# EAGLE schematic Farmduino_bêta (EAGLE 7.2.0)

## Sheet 1 of 2
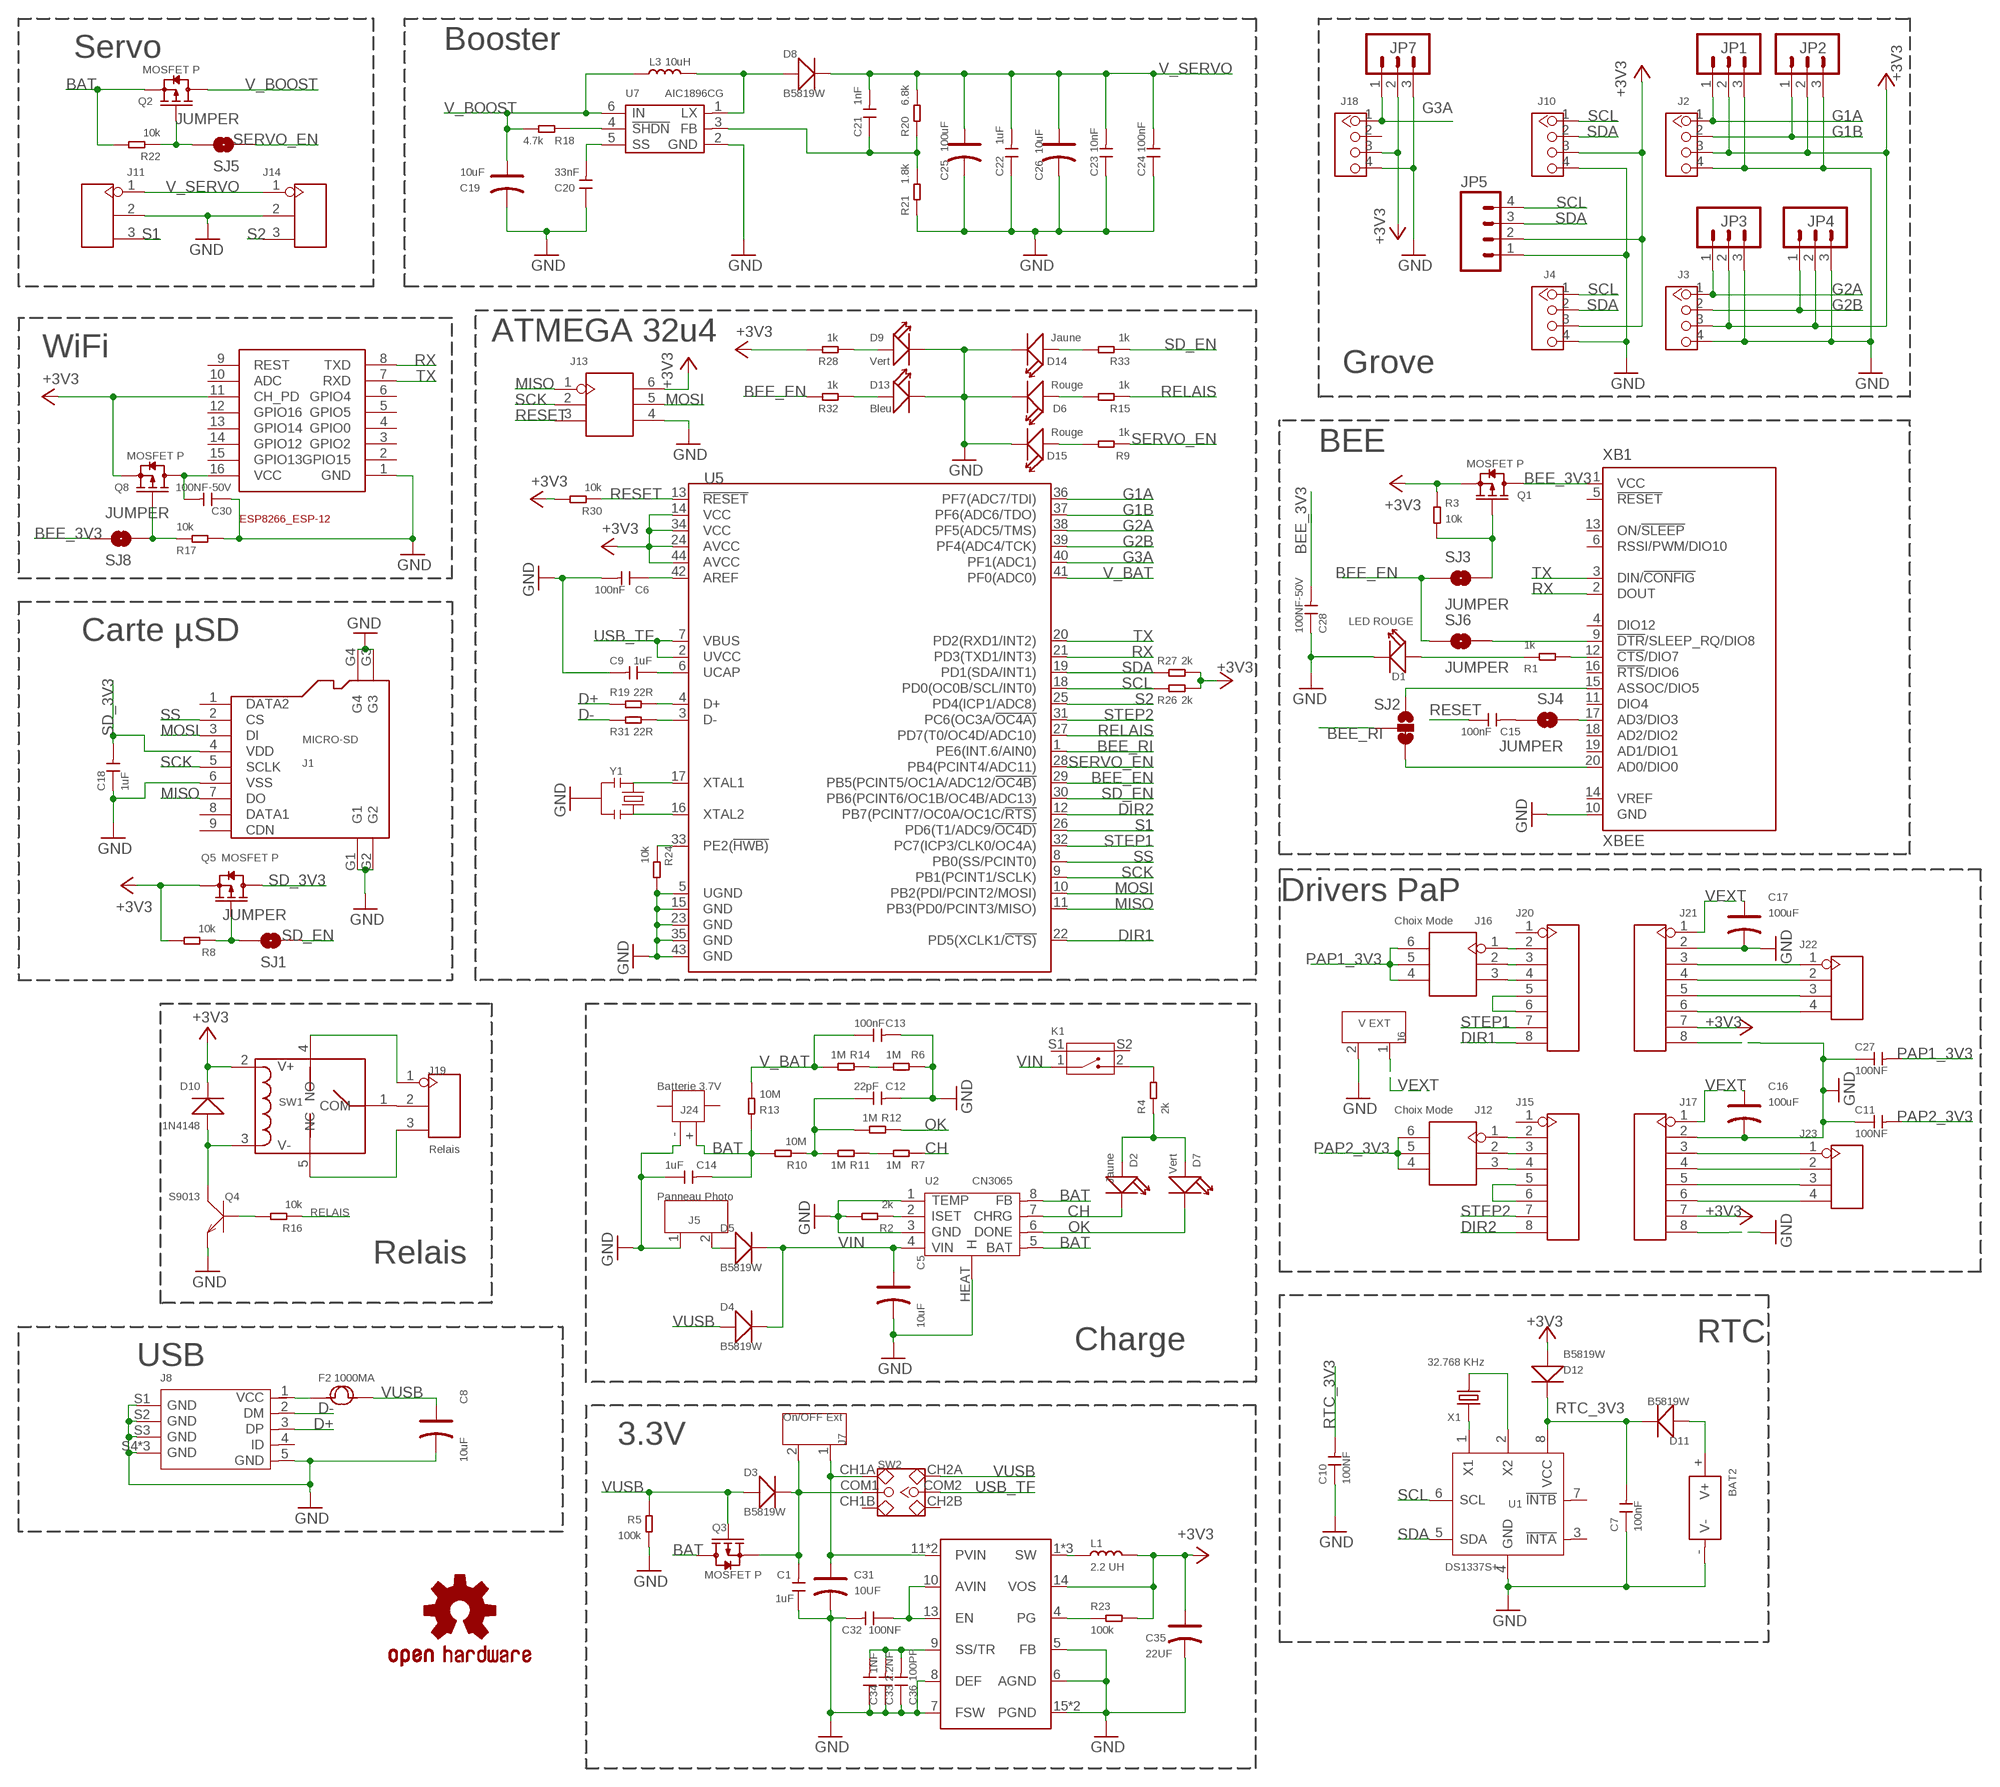
[diagram p0: schematic, sheet 1]

### Parts
BAT2  SMD-BATTERY-CELL-HOLDER-PLASTIC  [BAT2P-SMD-16.4-CR1220]
C1  1uF  CERAMIC-1UF-25V-10%-X7R(0805)  [C0805]
C5  10uF  TANTALUM-SMD-10UF-16V-10%(AVX-A)  [AVX-A]
C6  100nF  CERAMIC-100NF-50V-10%-X7R(0805)  [C0805]
C7  100nF  CERAMIC-100NF-50V-10%-X7R(0805)  [C0805]
C8  10uF  TANTALUM-SMD-10UF-16V-10%(AVX-A)  [AVX-A]
C9  1uF  CERAMIC-1UF-25V-10%-X7R(0805)  [C0805]
C10  100NF  CERAMIC-100NF-50V-10%-X7R(0805)  [C0805]
C11  100NF  CERAMIC-100NF-50V-10%-X7R(0805)  [C0805]
C12  22pF  CERAMIC-22PF-50V-5%-NPO(0805)  [C0805]
C13  100nF  CERAMIC-100NF-50V-10%-X7R(0805)  [C0805]
C14  1uF  CERAMIC-1UF-25V-10%-X7R(0805)  [C0805]
C15  100nF  CERAMIC-100NF-50V-10%-X7R(0805)  [C0805]
C16  100uF  ALUMINUM-SMD-100UF-50V-20%  [ELECTRO-SMD-C-6MM]
C17  100uF  ALUMINUM-SMD-100UF-50V-20%  [ELECTRO-SMD-C-6MM]
C18  1uF  CERAMIC-1UF-25V-10%-X7R(0805)  [C0805]
C19  10uF  TANTALUM-SMD-10UF-10V-10%(AVX-A)  [AVX-A]
C20  33nF  CERAMIC-33NF-50V-10%-X7R(0603)  [C0603]
C21  1nF  CERAMIC-1NF-50V-5%-C0G(0603)  [C0603]
C22  1uF  CERAMIC-1UF-25V-10%-X7R(0805)  [C0805]
C23  10nF  CERAMIC-10NF-50V-5%-X7R(0805)  [C0805]
C24  100nF  CERAMIC-100NF-50V-10%-X7R(0805)  [C0805]
C25  100uF  TANTALUM-SMD-100UF-10V(AVX-B)  [AVX-B]
C26  10uF  TANTALUM-SMD-10UF-16V-10%(AVX-A)  [AVX-A]
C27  100NF  CERAMIC-100NF-50V-10%-X7R(0805)  [C0805]
C28  100NF-50V  CERAMIC-100NF-50V-10%-X7R(0805)  [C0805]
C30  100NF-50V  CERAMIC-100NF-50V-10%-X7R(0805)  [C0805]
C31  10UF  TANTALUM-SMD-10UF-16V-10%(AVX-A)  [AVX-A]
C32  100NF  CERAMIC-100NF-50V-10%-X7R(0805)  [C0805]
C33  2.2NF  CERAMIC-2.2NF-50V-10%-X7R(0603)  [C0603]
C34  1NF  CERAMIC-1NF-50V-5%-C0G(0603)  [C0603]
C35  22UF  TANTALUM-SMD-22UF-16V(AVX-B)  [AVX-B]
C36  100PF  CERAMIC-100PF-50V-5%-NPO(0603)  [C0603]
D1  LED ROUGE  LED-SMD-RED-DIFFUSED(0603)  [LED-0603]
D2  Jaune  SMD-LED-CLEAR-YELLOW(0805)  [LED-0805]
D3  B5819W  SMD-DIODE-SCHOTTKY-20V-1A(SOD-123)  [SOD-123]
D4  B5819W  SMD-DIODE-SCHOTTKY-20V-1A(SOD-123)  [SOD-123]
D5  B5819W  SMD-DIODE-SCHOTTKY-20V-1A(SOD-123)  [SOD-123]
D6  Rouge  LED-SMD-RED-DIFFUSED(0603)  [LED-0603]
D7  Vert  SMD-LED-CLEAR-GREEN(0805)  [LED-0805]
D8  B5819W  SMD-DIODE-SCHOTTKY-20V-1A(SOD-123)  [SOD-123]
D9  Vert  SMD-LED-CLEAR-GREEN(0603)  [LED-0603]
D10  1N4148  SMD-DIODE-SWITCH-1N4148(LL-34)  [LL-34]
D11  B5819W  SMD-DIODE-SCHOTTKY-20V-1A(SOD-123)  [SOD-123]
D12  B5819W  SMD-DIODE-SCHOTTKY-20V-1A(SOD-123)  [SOD-123]
D13  Bleu  SMD-LED-CLEAR-BLUE(0603)  [LED-0603]
D14  Jaune  SMD-LED-CLEAR-YELLOW(0603)  [LED-0603]
D15  Rouge  LED-SMD-RED-DIFFUSED(0603)  [LED-0603]
F2  1000MA  SMD-PPTC-1000MA-8V(1206)  [F1206]
J1  MICRO-SD  MICRO-SD-CARD-SOCKET-9P(ST-TF-003A)  [MICRO-SD9+4P-SMD-16.1X14.5X1.85MM]
J2  GROVE-CONNECTOR-DIP(4P-2.0)  [HW4-2.0]
J3  GROVE-CONNECTOR-DIP(4P-2.0)  [HW4-2.0]
J4  GROVE-CONNECTOR-DIP(4P-2.0)  [HW4-2.0]
J5  Panneau Photo  SCREW-TERMINAL-GREEN(2P-3.5)  [H2-3.5-7.0X7.0MM]
J6  V EXT  SCREW-TERMINAL-GREEN(2P-3.5)  [H2-3.5-7.0X7.0MM]
J7  On/OFF Ext  SCREW-TERMINAL-GREEN(2P-3.5)  [H2-3.5-7.0X7.0MM]
J8  MICRO-USB-SMD-B-WITHOUT-POST-W/P(ST-USB-001G)  [MICRO-USB5+4P-SMD-0.65-B]
J10  GROVE-CONNECTOR-DIP(4P-2.0)  [HW4-2.0]
J11  DIP-WHITE-MALE-HEADER-VERT(3P-2.54)  [H3-2.54]
J12  Choix Mode  DIP-YELLOW-MALE-HEADER-VERT(2X3P-2.54)  [H2X3-2.54]
J13  DIP-BLACK-MALE-HEADER（2X3P-2.54）-2.54  [H2X3-2.54]
J14  DIP-WHITE-MALE-HEADER-VERT(3P-2.54)  [H3-2.54]
J15  DIP-YELLOW-FEMALE-HEADER(8P-2.54)  [H8-2.54]
J16  Choix Mode  DIP-YELLOW-MALE-HEADER-VERT(2X3P-2.54)  [H2X3-2.54]
J17  DIP-YELLOW-FEMALE-HEADER(8P-2.54)  [H8-2.54]
J18  GROVE-CONNECTOR-DIP(4P-2.0)  [HW4-2.0]
J19  Relais  SCREW-TERMINAL-GREEN(3P-5.0)  [H3-5.0-15.5X8.0MM]
J20  DIP-YELLOW-FEMALE-HEADER(8P-2.54)  [H8-2.54]
J21  DIP-YELLOW-FEMALE-HEADER(8P-2.54)  [H8-2.54]
J22  DIP-BLACK-MALE-HEADER-VERT(4P-2.54)  [H4-2.54]
J23  DIP-BLACK-MALE-HEADER-VERT(4P-2.54)  [H4-2.54]
J24  Batterie 3.7V  SMD-JST-2P-1.0-90D  [HW2-SMD-1.0-90D]
JP1  M03SCREW  [SCREWTERMINAL-3.5MM-3]
JP2  M03SCREW  [SCREWTERMINAL-3.5MM-3]
JP3  M03SCREW  [SCREWTERMINAL-3.5MM-3]
JP4  M03SCREW  [SCREWTERMINAL-3.5MM-3]
JP5  M04SCREW  [SCREWTERMINAL-3.5MM-4]
JP7  M03SCREW  [SCREWTERMINAL-3.5MM-3]
K1  SMD-BUTTON-2+2P  [SW4-SMD-7.0X3.5X3.5MM-90D]
L1  2.2 UH  SMD-INDUCTOR-2.2UH-20%-1.2A(0805)  [L0805]
L3  10uH  SMD-INDUCTOR-10UH-20%-900MA(L1210)  [L1210]
LOGO1  OSHW-LOGOM  [OSHW-LOGO-M]
Q1  MOSFET P  SMD-MOSFET-P-CH-8V-4.1A(SOT-23)  [SOT-23]
Q2  MOSFET P  SMD-MOSFET-P-CH-8V-4.1A(SOT-23)  [SOT-23]
Q3  MOSFET P  SMD-MOSFET-P-CH-8V-4.1A(SOT-23)  [SOT-23]
Q4  S9013  SMD-TRANSISTORS-NPN-25V-500MA(SOT-23)  [SOT-23]
Q5  MOSFET P  SMD-MOSFET-P-CH-8V-4.1A(SOT-23)  [SOT-23]
Q8  MOSFET P  SMD-MOSFET-P-CH-8V-4.1A(SOT-23)  [SOT-23]
R1  1k  SMD-RES-1K-5%-1/8W(0805)  [R0805]
R2  2k  SMD-RES-2K-5%-1/8W(0805)  [R0805]
R3  10k  SMD-RES-10K-1%-1/8W(0805)  [R0805]
R4  2k  SMD-RES-2K-5%-1/8W(0805)  [R0805]
R5  100k  SMD-RES-100K-1%-1/8W(0805)  [R0805]
R6  1M  SMD-RES-1M-1%-1/16W(0402)  [R0402]
R7  1M  SMD-RES-1M-1%-1/16W(0402)  [R0402]
R8  10k  SMD-RES-10K-1%-1/8W(0805)  [R0805]
R9  1k  SMD-RES-1K-5%-1/8W(0805)  [R0805]
R10  10M  SMD-RES-10M-1%-1/10W(0603)  [R0603]
R11  1M  SMD-RES-1M-1%-1/16W(0402)  [R0402]
R12  1M  SMD-RES-1M-5%-1/8W(0805)  [R0805]
R13  10M  SMD-RES-10M-1%-1/10W(0603)  [R0603]
R14  1M  SMD-RES-1M-1%-1/16W(0402)  [R0402]
R15  1k  SMD-RES-1K-5%-1/8W(0805)  [R0805]
R16  10k  SMD-RES-10K-1%-1/8W(0805)  [R0805]
R17  10k  SMD-RES-10K-1%-1/8W(0805)  [R0805]
R18  4.7k  SMD-RES-4.7K-5%-1/8W(0805)  [R0805]
R19  22R  SMD-RES-22R-5%-1/8W(0805)  [R0805]
R20  6.8k  SMD-RES-6.8K-1%-1/10W(0603)  [R0603]
R21  1.8k  SMD-RES-1.8K-1%-1/10W(0603)  [R0603]
R22  10k  SMD-RES-10K-1%-1/8W(0805)  [R0805]
R23  100k  SMD-RES-100K-1%-1/8W(0805)  [R0805]
R24  10k  SMD-RES-10K-1%-1/8W(0805)  [R0805]
R26  2k  SMD-RES-2K-5%-1/10W(0603)  [R0603]
R27  2k  SMD-RES-2K-5%-1/8W(0805)  [R0805]
R28  1k  SMD-RES-1K-5%-1/8W(0805)  [R0805]
R30  10k  SMD-RES-10K-1%-1/8W(0805)  [R0805]
R31  22R  SMD-RES-22R-5%-1/8W(0805)  [R0805]
R32  1k  SMD-RES-1K-5%-1/8W(0805)  [R0805]
R33  1k  SMD-RES-1K-5%-1/8W(0805)  [R0805]
SJ1  JUMPER  JUMPER-PAD-2-NO  [PAD-JUMPER-2-NO_NO_SILK]
SJ2  JUMPER-PAD-3-2OF3_NC_BY_TRACE_LARGE  [PAD-JUMPER-3-2OF3_NC_BY_TRACE_YES_SILK_LARGE]
SJ3  JUMPER  JUMPER-PAD-2-NO  [PAD-JUMPER-2-NO_NO_SILK]
SJ4  JUMPER  JUMPER-PAD-2-NO  [PAD-JUMPER-2-NO_NO_SILK]
SJ5  JUMPER  JUMPER-PAD-2-NO  [PAD-JUMPER-2-NO_NO_SILK]
SJ6  JUMPER  JUMPER-PAD-2-NO  [PAD-JUMPER-2-NO_NO_SILK]
SJ8  JUMPER  JUMPER-PAD-2-NO  [PAD-JUMPER-2-NO_NO_SILK]
SW1  RELAY-HLS8L-DC3V-S-C(5P-19X15MM)  [REY5-19.0X15.0X15.0MM]
SW2  DIP-TOGGLE-SWITCH-2CH-(2X3P-90D)  [SW6-2.54-9.0X3.5X3.2MM-90D]
U1  DS1337S+  CLOCK-DS1337S+(SOIC8)  [SOIC8-1.27-5X4MM]
U2  CN3065  PMIC-CN3065(DFN8)  [DFN8G-0.5-3X3MM]
U3  TPS62132RGTR  PMIC-TPS62132RGTR(QFN16)  [QFN16G-0.5-3X3MM]
U5  MCU-ATMEGA32U4(TQFP44)-AU  [TQFP44-0.8-9.6X9.6MM]
U7  AIC1896CG  PMIC-AIC1896CG(SOT23-6)  [SOT-23-6]
U$1  ESP8266_ESP-12  [ESP8266-ESP12]
X1  32.768 KHz  SMD-CRYSTAL-ABS07-32.768KHZ-7PF-20PPM-70K(2P-3.2X1.5MM)  [X2-SMD-3.2X1.5X0.55MM]
XB1  XBEE  [XBEE]
Y1  SMD-CRYSTAL-8MHZ--0.3%-150R(3P-3.6X1.3MM)  [X3-SMD-3.6X1.3X0.8MM]

### Nets
!SHDN: R18.2 U7.4(!SHDN)
+3V3: C35.+ D10.C(-) D12.+ J2.3 J3.3 J4.3 J10.3 J13.6 J17.7 J18.3 J21.7 JP1.2 JP2.2 JP3.2 JP4.2 JP5.2 JP7.2 L1.2 Q1.2(S) Q5.2(S) Q8.2(S) R3.1 R8.2 R23.2 R26.1 R27.1 R28.2 R30.2 SW1.2(V+) U3.14(VOS) U5.14(VCC) U5.24(AVCC) U5.34(VCC) U5.44(AVCC) U$1.11(CH_PD)
A7: C12.1 R10.1 R11.2 R12.2
BAT: C14.2 J24.+ Q2.2(S) Q3.3(D) R10.2 R13.2 R22.2 U2.5(BAT) U2.8(FB)
BEE_3V3: C28.2 Q1.3(D) SJ8.1 XB1.1(VCC)
BEE_CTS: R1.2 XB1.12(!CTS!/DIO7)
BEE_EN: R32.2 SJ3.1 SJ6.1 U5.29(PB5(PCINT5/OC1A/ADC12/!OC4B))
BEE_RI: SJ2.2 U5.1(PE6(INT.6/AIN0))
CH: D2.- R7.1 U2.7(CHRG)
D6: D1.+ R1.1
D+: J8.3(DP) R19.1
D-: J8.2(DM) R31.1
DIR1: J20.8 U5.22(PD5(XCLK1/!CTS))
DIR2: J15.8 U5.12(PB7(PCINT7/OC0A/OC1C/!RTS))
G1A: J2.1 JP1.1 U5.36(PF7(ADC7/TDI))
G1B: J2.2 JP2.1 U5.37(PF6(ADC6/TDO))
G2A: J3.1 JP3.1 U5.38(PF5(ADC5/TMS))
G2B: J3.2 JP4.1 U5.39(PF4(ADC4/TCK))
G3A: J18.1 JP7.1 U5.40(PF1(ADC1))
GND: BAT2.-(V-) C1.1 C5.- C6.2 C7.1 C8.- C9.2 C10.1 C11.1 C12.2 C13.2 C14.1 C16.- C17.- C18.1 C19.- C20.1 C22.1 C23.1 C24.1 C25.- C26.- C27.1 C28.1 C30.1 C31.- C32.2 C33.1 C34.1 C35.- C36.1 D1.- D6.- D9.- D13.- D14.- D15.- J1.6(VSS) J1.G1 J1.G2 J1.G3 J1.G4 J2.4 J3.4 J4.4 J5.1 J6.2 J8.5(GND) J8.S1(GND) J8.S2(GND) J8.S3(GND) J8.S4(GND) J8.S5(GND) J8.S6(GND) J10.4 J11.2 J13.4 J14.2 J17.2 J17.8 J18.4 J21.2 J21.8 J24.- JP1.3 JP2.3 JP3.3 JP4.3 JP5.1 JP7.3 Q4.2(E) R2.2 R5.1 R6.1 R17.2 R21.1 R24.2 U1.4(GND) U2.1(TEMP) U2.3(GND) U2.HEAT(H) U3.5(FB) U3.6(AGND) U3.7(FSW) U3.8(DEF) U3.15(PGND) U3.16(PGND) U5.5(UGND) U5.15(GND) U5.23(GND) U5.35(GND) U5.43(GND) U7.2(GND) U$1.1(GND) XB1.10(GND) Y1.2
MISO: J1.7(DO) J13.1 U5.11(PB3(PD0/PCINT3/MISO))
MOSI: J1.3(DI) J13.5 U5.10(PB2(PDI/PCINT2/MOSI))
N$1: K1.2 R4.2
N$2: J15.5 J15.6
N$3: D9.+ R28.1
N$4: SJ4.1 XB1.17(AD3/DIO3)
N$5: D13.+ R32.1
N$6: SJ2.1 XB1.15(ASSOC/DIO5)
N$7: SJ2.3 XB1.20(AD0/DIO0)
N$8: R2.1 U2.2(ISET)
N$9: U1.1(X1) X1.1
N$10: U1.2(X2) X1.2
N$11: C15.2 SJ4.2
N$12: U5.16(XTAL2) Y1.3
N$13: BAT2.+(V+) D11.+
N$14: R6.2 R14.1
N$15: D2.+ D7.+ R4.1
N$16: D5.+ J5.2
N$17: R7.2 R11.1
N$18: Q1.1(G) R3.2 SJ3.2
N$19: C1.2 D3.- J7.2 Q3.2(S) SW2.COM1
N$20: C31.+ J7.1 SW2.CH1A U3.11(PVIN) U3.12(PVIN)
N$21: Q5.1(G) R8.1 SJ1.2
N$22: C30.2 Q8.3(D) U$1.16(VCC)
N$23: C20.2 U7.5(SS)
N$24: D8.+ L3.2 U7.1(LX)
N$25: C21.1 R20.1 R21.2 U7.3(FB)
N$26: Q2.1(G) R22.1 SJ5.2
N$27: J16.3 J20.4
N$28: J16.2 J20.3
N$29: D14.+ R33.2
N$30: J16.1 J20.2
N$31: J12.3 J15.4
N$32: J12.2 J15.3
N$33: R24.1 U5.33(PE2(!HWB))
N$34: R31.2 U5.3(D-)
N$35: C9.1 U5.6(UCAP)
N$36: F2.1 J8.1(VCC)
N$37: D6.+ R15.2
N$38: J12.1 J15.2
N$39: J20.5 J20.6
N$41: Q8.1(G) R17.1 SJ8.2
N$42: R19.2 U5.4(D+)
N$43: SJ6.2 XB1.9(!DTR!/SLEEP_RQ/DIO8)
N$44: R23.1 U3.4(PG)
N$46: D15.+ R9.2
N$47: J17.3 J23.1
N$48: J17.4 J23.2
N$49: J17.5 J23.3
N$50: J17.6 J23.4
N$51: C33.2 C34.2 C36.2 U3.9(SS/TR)
N$52: L1.1 U3.1(SW) U3.2(SW) U3.3(SW)
N$53: J21.3 J22.1
N$54: J21.4 J22.2
N$55: J21.5 J22.3
N$56: J21.6 J22.4
N$57: Q4.1(B) R16.2
N$58: D10.A(+) Q4.3(C) SW1.3(V-)
N$61: J19.2 SW1.1(COM)
N$63: C32.1 U3.10(AVIN) U3.13(EN)
N$77: U5.17(XTAL1) Y1.1
N$80: C6.1 U5.42(AREF)
NC1: J19.3 SW1.5(NC)
NO1: J19.1 SW1.4(NO)
OK: D7.- R12.1 U2.6(DONE)
PAP1_3V3: C27.2 J16.4 J16.5 J16.6
PAP2_3V3: C11.2 J12.4 J12.5 J12.6
RELAIS: R15.1 R16.1 U5.27(PD7(T0/OC4D/ADC10))
RESET: C15.1 J13.3 R30.1 U5.13(!RESET)
RTC_3V3: C7.2 C10.2 D11.- D12.- U1.8(VCC)
RX: U5.21(PD3(TXD1/INT3)) U$1.8(TXD) XB1.2(DOUT)
S1: J11.3 U5.26(PD6(T1/ADC9/!OC4D))
S2: J14.3 U5.25(PD4(ICP1/ADC8))
SCK: J1.5(SCLK) J13.2 U5.9(PB1(PCINT1/SCLK))
SCL: J4.1 J10.1 JP5.4 R26.2 U1.6(SCL) U5.18(PD0(OC0B/SCL/INT0))
SD_3V3: C18.2 J1.4(VDD) Q5.3(D)
SD_EN: R33.1 SJ1.1 U5.30(PB6(PCINT6/OC1B/OC4B/ADC13))
SDA: J4.2 J10.2 JP5.3 R27.2 U1.5(SDA) U5.19(PD1(SDA/INT1))
SERVO_EN: R9.1 SJ5.1 U5.28(PB4(PCINT4/ADC11))
SS: J1.2(CS) U5.8(PB0(SS/PCINT0))
STEP1: J20.7 U5.32(PC7(ICP3/CLK0/OC4A))
STEP2: J15.7 U5.31(PC6(OC3A/!OC4A))
TX: U5.20(PD2(RXD1/INT2)) U$1.7(RXD) XB1.3(DIN/!CONFIG)
USB_TF: SW2.COM2 U5.2(UVCC) U5.7(VBUS)
V_BAT: C13.1 R13.1 R14.2 U5.41(PF0(ADC0))
V_BOOST: C19.+ L3.1 Q2.3(D) R18.1 U7.6(IN)
V_SERVO: C21.2 C22.2 C23.2 C24.2 C25.+ C26.+ D8.- J11.1 J14.1 R20.2
VEXT: C16.+ C17.+ J6.1 J17.1 J21.1
VIN: C5.+ D4.- D5.- K1.1 U2.4(VIN)
VUSB: C8.+ D3.+ D4.+ F2.2 Q3.1(G) R5.2 SW2.CH2A
Unconnected: J1.1(DATA2) J1.8(DATA1) J1.9(CDN) J8.4(ID) J15.1 J18.2 J20.1 J24.3 J24.4 K1.S1 K1.S2 SW2.CH1B SW2.CH2B U1.3(!INTA!) U1.7(!INTB!) U$1.2(GPIO15) U$1.3(GPIO2) U$1.4(GPIO0) U$1.5(GPIO5) U$1.6(GPIO4) U$1.9(REST) U$1.10(ADC) U$1.12(GPIO16) U$1.13(GPIO14) U$1.14(GPIO12) U$1.15(GPIO13) XB1.4(DIO12) XB1.5(!RESET) XB1.6(RSSI/PWM/DIO10) XB1.11(DIO4) XB1.13(ON/!SLEEP) XB1.14(VREF) XB1.16(!RTS!/DIO6) XB1.18(AD2/DIO2) XB1.19(AD1/DIO1)

### Notes on the sheet
- Servo | Booster
- ATMEGA 32u4
- WiFi
- Grove
- BEE
- Carte µSD
- Drivers PaP
- Relais
- Charge | RTC
- USB
- 3.3V

## Sheet 2 of 2

## Library data of the parts
BAT2 = 0_Seeed-OPL-Connector:SMD-BATTERY-CELL-HOLDER-PLASTIC: 320170000; OC_FARNELL: unknown
C1 C14 C18 C22 = 0_Seeed-OPL-Capacitor:CERAMIC-1UF-25V-10%-X7R(0805): 302010179; MF: AVX; MPN: 02016D105MAT2A; OC_FARNELL: 1867951
C5 C8 = 0_Seeed-OPL-Capacitor:TANTALUM-SMD-10UF-16V-10%(AVX-A): 302020002; MF: AVX; MPN: 06036D106MAT2A; OC_FARNELL: 2448826
C6 C7 C13 C15 C24 = 0_Seeed-OPL-Capacitor:CERAMIC-100NF-50V-10%-X7R(0805): 302010165; MF: AVX; MPN: 0402ZD104KAT2A; OC_FARNELL: 2280810
C9 = 0_Seeed-OPL-Capacitor:CERAMIC-1UF-25V-10%-X7R(0805): 302010179; MF: AVX; MPN: CC0805KKX7R8BB105; OC_FARNELL: 1867951
C10 C11 C27 C28 C30 = 0_Seeed-OPL-Capacitor:CERAMIC-100NF-50V-10%-X7R(0805): 302010165; OC_FARNELL: unknown
C12 = 0_Seeed-OPL-Capacitor:CERAMIC-22PF-50V-5%-NPO(0805): 302010151; OC_FARNELL: unknown
C16 C17 = 0_Seeed-OPL-Capacitor:ALUMINUM-SMD-100UF-50V-20%: 302030090; MF: AVX; MPN: 06036D106MAT2A; OC_FARNELL: 2448826
C19 = 0_Seeed-OPL-Capacitor:TANTALUM-SMD-10UF-10V-10%(AVX-A): 302020011; MPN: TAJA106K010RNJ; OC_FARNELL: unknown
C20 = 0_Seeed-OPL-Capacitor:CERAMIC-33NF-50V-10%-X7R(0603): 302010088; OC_FARNELL: unknown
C21 C34 = 0_Seeed-OPL-Capacitor:CERAMIC-1NF-50V-5%-C0G(0603): 302010341; OC_FARNELL: unknown
C23 = 0_Seeed-OPL-Capacitor:CERAMIC-10NF-50V-5%-X7R(0805): 302010175; OC_FARNELL: unknown
C25 = 0_Seeed-OPL-Capacitor:TANTALUM-SMD-100UF-10V(AVX-B): 302020015; OC_FARNELL: unknown
C26 C31 = 0_Seeed-OPL-Capacitor:TANTALUM-SMD-10UF-16V-10%(AVX-A): 302020002; MPN: TAJA106K016RNJ; OC_FARNELL: unknown
C32 = 0_Seeed-OPL-Capacitor:CERAMIC-100NF-50V-10%-X7R(0805): 302010165; MPN: CC0805KRX7R9BB104; OC_FARNELL: unknown
C33 = 0_Seeed-OPL-Capacitor:CERAMIC-2.2NF-50V-10%-X7R(0603): 302010056; OC_FARNELL: unknown
C35 = 0_Seeed-OPL-Capacitor:TANTALUM-SMD-22UF-16V(AVX-B): 302020013; MPN: TAJB226*016#NJ; OC_FARNELL: unknown
C36 = 0_Seeed-OPL-Capacitor:CERAMIC-100PF-50V-5%-NPO(0603): 302010076; OC_FARNELL: unknown
D1 D6 D15 = 0_Seeed-OPL-Diode:LED-SMD-RED-DIFFUSED(0603): 304090042; OC_FARNELL: unknown
D2 = 0_Seeed-OPL-Diode:SMD-LED-CLEAR-YELLOW(0805): 304090039; MPN: 17-215UYC/S530-A3/TR8; OC_FARNELL: unknown
D3-D5 D8 D11 D12 = 0_Seeed-OPL-Diode:SMD-DIODE-SCHOTTKY-20V-1A(SOD-123): 304020034; OC_FARNELL: unknown
D7 = 0_Seeed-OPL-Diode:SMD-LED-CLEAR-GREEN(0805): 304090057; MPN: 17-215SYGC/S530-E2/TR8; OC_FARNELL: unknown
D9 = 0_Seeed-OPL-Diode:SMD-LED-CLEAR-GREEN(0603): 304090043; OC_FARNELL: unknown
D10 = 0_Seeed-OPL-Diode:SMD-DIODE-SWITCH-1N4148(LL-34): 304040016; OC_FARNELL: unknown
D13 = 0_Seeed-OPL-Diode:SMD-LED-CLEAR-BLUE(0603): 304090045; OC_FARNELL: unknown
D14 = 0_Seeed-OPL-Diode:SMD-LED-CLEAR-YELLOW(0603): 304090044; OC_FARNELL: unknown
F2 = 0_Seeed-OPL-fuse:SMD-PPTC-1000MA-8V(1206): 307010001; MPN: KT8-1000SMD1206
J1 = 0_Seeed-OPL-Connector:MICRO-SD-CARD-SOCKET-9P(ST-TF-003A): 320090000; MPN: ST-TF-003A; OC_FARNELL: unknown
J2-J4 J10 J18 = 0_Seeed-OPL-Connector:GROVE-CONNECTOR-DIP(4P-2.0): 320110033; OC_FARNELL: unknown
J5 J6 = 0_Seeed-OPL-Connector:SCREW-TERMINAL-GREEN(2P-3.5): 320110028; MF: TE CONNECTIVITY; MPN: 1776275-2; OC_FARNELL: 1098611
J7 = 0_Seeed-OPL-Connector:SCREW-TERMINAL-GREEN(2P-3.5): 320110028; OC_FARNELL: unknown
J8 = 0_Seeed-OPL-Connector:MICRO-USB-SMD-B-WITHOUT-POST-W/P(ST-USB-001G): 320010000; MPN: ST-USB-001G; OC_FARNELL: unknown
J11 J14 = 0_Seeed-OPL-Connector:DIP-WHITE-MALE-HEADER-VERT(3P-2.54): 320020038; MPN: P125-1103A0BS116A1
J12 J16 = 0_Seeed-OPL-Connector:DIP-YELLOW-MALE-HEADER-VERT(2X3P-2.54): 320020027; MPN: P125-1203A0BS116A2; OC_FARNELL: unknown
J13 = 0_Seeed-OPL-Connector:DIP-BLACK-MALE-HEADER（2X3P-2.54）: 320020077; MPN: P125-12A1BS116A1; OC_FARNELL: unknown
J15 J17 J20 J21 = 0_Seeed-OPL-Connector:DIP-YELLOW-FEMALE-HEADER(8P-2.54): 320030065; MPN: F185-1108A1BSYC1
J19 = 0_Seeed-OPL-Connector:SCREW-TERMINAL-GREEN(3P-5.0): 320110029; OC_FARNELL: unknown
J22 J23 = 0_Seeed-OPL-Connector:DIP-BLACK-MALE-HEADER-VERT(4P-2.54): 320020017; MPN: P125-1104A0BS116A1
J24 = 0_Seeed-OPL-Connector:SMD-JST-2P-1.0-90D: 320110054
JP1-JP4 JP7 = SparkFun-Connectors:M03: Header 3 Standard 3-pin 0.1" header. Use with straight break away headers (SKU : PRT-00116), right angle break away headers (PRT-00553), swiss pins (PRT-00743), machine pins (PRT-00117), and female headers (PRT-00115). Molex polarized connector foot print use with SKU : PRT-08232 with associated crimp pins and housings.; OC_FARNELL: unknown; PROD_ID: CONN-08288
JP5 = SparkFun-Connectors:M04: Header 4 Standard 4-pin 0.1" header. Use with straight break away headers (SKU : PRT-00116), right angle break away headers (PRT-00553), swiss pins (PRT-00743), machine pins (PRT-00117), and female headers (PRT-00115). Molex polarized connector foot print use with SKU : PRT-08231 with associated crimp pins and housings. 1MM SMD Version SKU: PRT-10208; OC_FARNELL: unknown
K1 = 0_Seeed-OPL-Button:SMD-BUTTON-2+2P: 311020023; MPN: TS-1188E; OC_FARNELL: unknown
L1 = 0_Seeed-OPL-Inductor:SMD-INDUCTOR-2.2UH-20%-1.2A(0805): 303010086; MPN: LQM2MPN2R2MG0; OC_FARNELL: unknown
L3 = 0_Seeed-OPL-Inductor:SMD-INDUCTOR-10UH-20%-900MA(L1210): 303010108; MPN: CBC3225T100MR; OC_FARNELL: unknown
LOGO1 = SparkFun-Aesthetics:OSHW-LOGO: Open Source Hardware Logo This logo indicates the piece of hardware it is found on incorporates a OSHW license and/or adheres to the definition of open source hardware found here: http://freedomdefined.org/OSHW
Q1-Q3 Q5 Q8 = 0_Seeed-OPL-Transistor:SMD-MOSFET-P-CH-8V-4.1A(SOT-23): 305030014; OC_FARNELL: unknown
Q4 = 0_Seeed-OPL-Transistor:SMD-TRANSISTORS-NPN-25V-500MA(SOT-23): 305010018; MPN: S9013; OC_FARNELL: unknown
R1 R9 R15 R28 R32 R33 = 0_Seeed-OPL-Resistor:SMD-RES-1K-5%-1/8W(0805): 301010311; MF: STEINBACH AND VOLLMANN; MPN: RC0805JR-071KL; OC_FARNELL: 1516458
R2 R4 R27 = 0_Seeed-OPL-Resistor:SMD-RES-2K-5%-1/8W(0805): 301010318; MPN: RC0805JR-072KL; OC_FARNELL: unknown
R3 R24 R30 = 0_Seeed-OPL-Resistor:SMD-RES-10K-1%-1/8W(0805): 301010361; MF: STEINBACH AND VOLLMANN; MPN: RC0805FR-0710KL; OC_FARNELL: 1516458
R5 R23 = 0_Seeed-OPL-Resistor:SMD-RES-100K-1%-1/8W(0805): 301010396; MPN: RC0805FR-07100KL; OC_FARNELL: unknown
R6 R7 R11 R14 = 0_Seeed-OPL-Resistor:SMD-RES-1M-1%-1/16W(0402): 301010043; MPN: RC0402FR-071ML; OC_FARNELL: unknown
R8 R16 R17 = 0_Seeed-OPL-Resistor:SMD-RES-10K-1%-1/8W(0805): 301010361; MPN: RC0805FR-0710KL; OC_FARNELL: unknown
R10 R13 = 0_Seeed-OPL-Resistor:SMD-RES-10M-1%-1/10W(0603): 301010153; MPN: RC0603FR-0710ML; OC_FARNELL: unknown
R12 = 0_Seeed-OPL-Resistor:SMD-RES-1M-5%-1/8W(0805): 301010321; MPN: RC0805JR-071ML; OC_FARNELL: unknown
R18 = 0_Seeed-OPL-Resistor:SMD-RES-4.7K-5%-1/8W(0805): 301010306; MPN: RC0805JR-074K7L; OC_FARNELL: unknown
R19 R31 = 0_Seeed-OPL-Resistor:SMD-RES-22R-5%-1/8W(0805): 301010329; MPN: RC0805JR-0722RL; OC_FARNELL: unknown
R20 = 0_Seeed-OPL-Resistor:SMD-RES-6.8K-1%-1/10W(0603): 301010198; MPN: RC0805JR-07220KL; OC_FARNELL: unknown
R21 = 0_Seeed-OPL-Resistor:SMD-RES-1.8K-1%-1/10W(0603): 301010254; MPN: RC0603FR-071K8L; OC_FARNELL: unknown
R22 = 0_Seeed-OPL-Resistor:SMD-RES-10K-1%-1/8W(0805): 301010361; OC_FARNELL: unknown
R26 = 0_Seeed-OPL-Resistor:SMD-RES-2K-5%-1/10W(0603): 301010113; MPN: RC0603JR-072KL; OC_FARNELL: unknown
SJ1 SJ3-SJ6 SJ8 = SparkFun-Passives:JUMPER-PAD-2-NO; OC_FARNELL: unknown
SJ2 = SparkFun-Passives:JUMPER-PAD-3-2OF3_NC_BY_TRACE; OC_FARNELL: unknown
SW1 = 0_Seeed-OPL-Relay:RELAY-HLS8L-DC3V-S-C(5P-19X15MM): 315030009; OC_FARNELL: unknown
SW2 = 0_Seeed-OPL-Switch:DIP-TOGGLE-SWITCH-2CH-(2X3P-90D): 311010004; MPN: MS-22D18-G2; OC_FARNELL: unknown
U1 = 0_Seeed-OPL-ic:CLOCK-DS1337S+(SOIC8): 310110008; OC_FARNELL: unknown
U2 = 0_Seeed-OPL-ic:PMIC-CN3065(DFN8): 310030101; DESCRIPTION: Lithium-Ion-Battery-Charger-for-Solar-Powered-Systems-4.2V; OC_FARNELL: unknown
U3 = 0_Seeed-OPL-ic:PMIC-TPS62132RGTR(QFN16): 310030129; OC_FARNELL: unknown
U5 = 0_Seeed-OPL-ic:MCU-ATMEGA32U4(TQFP44): 310010010; DESCRIPTION: IC-MCU-8Bit-32KB-ISP-flash&USB-controller-16MHz-2.7v-5.5v; OC_FARNELL: unknown
U7 = 0_Seeed-OPL-ic:PMIC-AIC1896CG(SOT23-6): 310030104; OC_FARNELL: unknown
U$1 = ESP8266-ESP12:ESP8266_ESP-12; OC_FARNELL: unknown
X1 = 0_Seeed-OPL-crystal-osctllator:SMD-CRYSTAL-ABS07-32.768KHZ-7PF-20PPM-70K(2P-3.2X1.5MM): 306010055; MPN: FC-135; OC_FARNELL: unknown
XB1 = xbee:XBEE: XBee (TM) /XBee-PRO(TM) OEM RF Modules Source: MaxStream, Inc. xbee_productmanual.pdf; MPN: XBP24-Z7UIT-004; OC_FARNELL: 1751799; OC_NEWARK: 34R5507
Y1 = 0_Seeed-OPL-crystal-osctllator:SMD-CRYSTAL-8MHZ--0.3%-150R(3P-3.6X1.3MM): 306010053